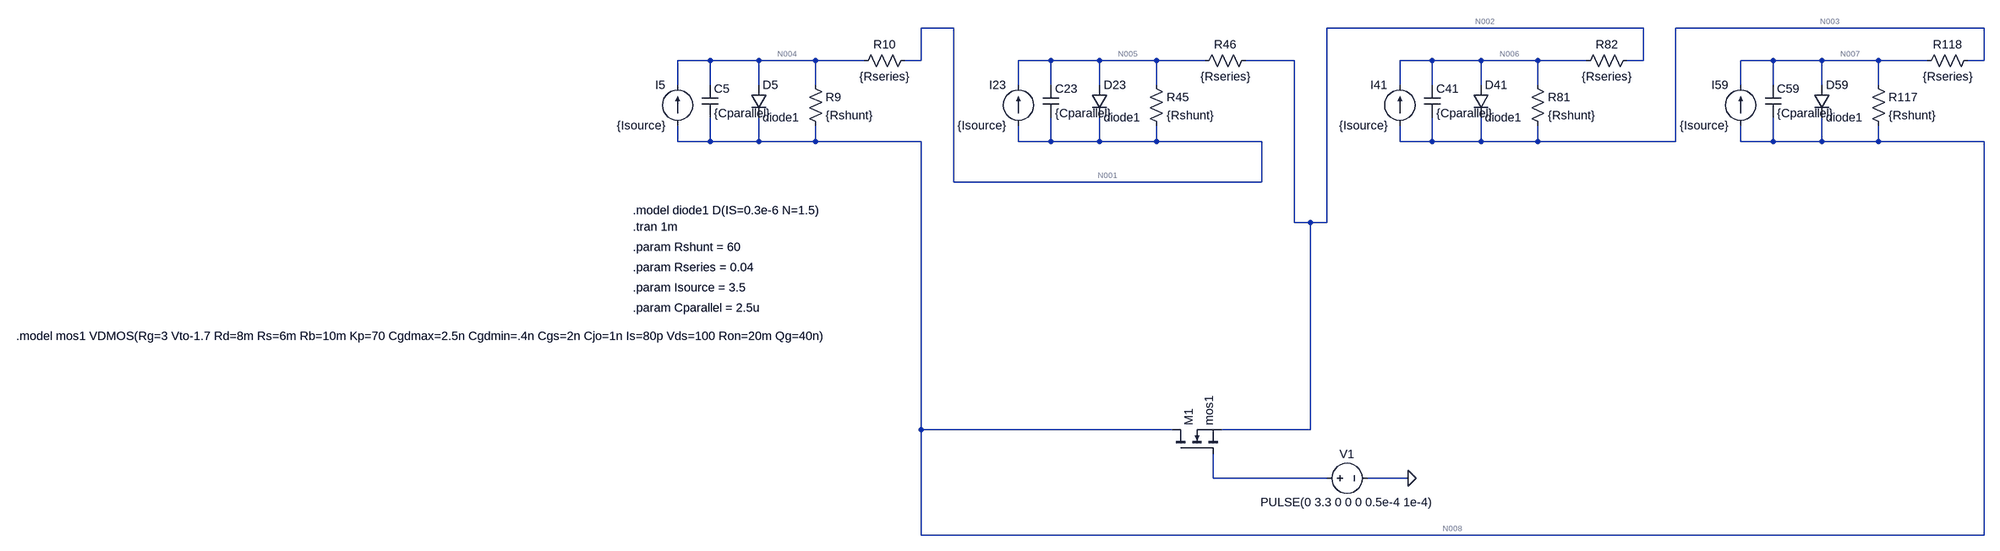
[diagram p0: schematic fetsim3.asc]
fetsim3.asc, the LTspice schematic file:
Version 4
SHEET 1 2564 1908
WIRE 528 848 464 848
WIRE 1888 848 1264 848
WIRE 2560 848 1952 848
WIRE 48 912 -16 912
WIRE 144 912 48 912
WIRE 256 912 144 912
WIRE 352 912 256 912
WIRE 464 912 464 848
WIRE 464 912 432 912
WIRE 720 912 656 912
WIRE 816 912 720 912
WIRE 928 912 816 912
WIRE 1024 912 928 912
WIRE 1200 912 1104 912
WIRE 1472 912 1408 912
WIRE 1568 912 1472 912
WIRE 1680 912 1568 912
WIRE 1776 912 1680 912
WIRE 1888 912 1888 848
WIRE 1888 912 1856 912
WIRE 2144 912 2080 912
WIRE 2240 912 2144 912
WIRE 2352 912 2240 912
WIRE 2448 912 2352 912
WIRE 2560 912 2560 848
WIRE 2560 912 2528 912
WIRE -16 960 -16 912
WIRE 48 960 48 912
WIRE 144 960 144 912
WIRE 256 960 256 912
WIRE 656 960 656 912
WIRE 720 960 720 912
WIRE 816 960 816 912
WIRE 928 960 928 912
WIRE 1408 960 1408 912
WIRE 1472 960 1472 912
WIRE 1568 960 1568 912
WIRE 1680 960 1680 912
WIRE 2080 960 2080 912
WIRE 2144 960 2144 912
WIRE 2240 960 2240 912
WIRE 2352 960 2352 912
WIRE -16 1072 -16 1040
WIRE 48 1072 48 1024
WIRE 48 1072 -16 1072
WIRE 144 1072 144 1024
WIRE 144 1072 48 1072
WIRE 256 1072 256 1040
WIRE 256 1072 144 1072
WIRE 464 1072 256 1072
WIRE 656 1072 656 1040
WIRE 720 1072 720 1024
WIRE 720 1072 656 1072
WIRE 816 1072 816 1024
WIRE 816 1072 720 1072
WIRE 928 1072 928 1040
WIRE 928 1072 816 1072
WIRE 1136 1072 928 1072
WIRE 1408 1072 1408 1040
WIRE 1472 1072 1472 1024
WIRE 1472 1072 1408 1072
WIRE 1568 1072 1568 1024
WIRE 1568 1072 1472 1072
WIRE 1680 1072 1680 1040
WIRE 1680 1072 1568 1072
WIRE 1952 1072 1952 848
WIRE 1952 1072 1680 1072
WIRE 2080 1072 2080 1040
WIRE 2144 1072 2144 1024
WIRE 2144 1072 2080 1072
WIRE 2240 1072 2240 1024
WIRE 2240 1072 2144 1072
WIRE 2352 1072 2352 1040
WIRE 2352 1072 2240 1072
WIRE 2560 1072 2352 1072
WIRE 528 1152 528 848
WIRE 1136 1152 1136 1072
WIRE 1136 1152 528 1152
WIRE 1200 1232 1200 912
WIRE 1232 1232 1200 1232
WIRE 1264 1232 1264 848
WIRE 1264 1232 1232 1232
WIRE 464 1696 464 1072
WIRE 960 1696 464 1696
WIRE 1232 1696 1232 1232
WIRE 1232 1696 1056 1696
WIRE 1040 1792 1040 1744
WIRE 1264 1792 1040 1792
WIRE 1424 1792 1344 1792
WIRE 464 1904 464 1696
WIRE 2560 1904 2560 1072
WIRE 2560 1904 464 1904
FLAG 1424 1792 0
SYMBOL current -16 1040 R180
WINDOW 0 24 80 Left 2
WINDOW 3 24 0 Left 2
WINDOW 123 0 0 Left 2
WINDOW 39 0 0 Left 2
SYMATTR InstName I5
SYMATTR Value {Isource}
SYMBOL cap 32 960 R0
SYMATTR InstName C5
SYMATTR Value {Cparallel}
SYMBOL diode 128 960 R0
SYMATTR InstName D5
SYMATTR Value diode1
SYMBOL res 240 944 R0
SYMATTR InstName R9
SYMATTR Value {Rshunt}
SYMBOL res 448 896 R90
WINDOW 0 0 56 VBottom 2
WINDOW 3 32 56 VTop 2
SYMATTR InstName R10
SYMATTR Value {Rseries}
SYMBOL current 656 1040 R180
WINDOW 0 24 80 Left 2
WINDOW 3 24 0 Left 2
WINDOW 123 0 0 Left 2
WINDOW 39 0 0 Left 2
SYMATTR InstName I23
SYMATTR Value {Isource}
SYMBOL cap 704 960 R0
SYMATTR InstName C23
SYMATTR Value {Cparallel}
SYMBOL diode 800 960 R0
SYMATTR InstName D23
SYMATTR Value diode1
SYMBOL res 912 944 R0
SYMATTR InstName R45
SYMATTR Value {Rshunt}
SYMBOL res 1120 896 R90
WINDOW 0 0 56 VBottom 2
WINDOW 3 32 56 VTop 2
SYMATTR InstName R46
SYMATTR Value {Rseries}
SYMBOL current 1408 1040 R180
WINDOW 0 24 80 Left 2
WINDOW 3 24 0 Left 2
WINDOW 123 0 0 Left 2
WINDOW 39 0 0 Left 2
SYMATTR InstName I41
SYMATTR Value {Isource}
SYMBOL cap 1456 960 R0
SYMATTR InstName C41
SYMATTR Value {Cparallel}
SYMBOL diode 1552 960 R0
SYMATTR InstName D41
SYMATTR Value diode1
SYMBOL res 1664 944 R0
SYMATTR InstName R81
SYMATTR Value {Rshunt}
SYMBOL res 1872 896 R90
WINDOW 0 0 56 VBottom 2
WINDOW 3 32 56 VTop 2
SYMATTR InstName R82
SYMATTR Value {Rseries}
SYMBOL current 2080 1040 R180
WINDOW 0 24 80 Left 2
WINDOW 3 24 0 Left 2
WINDOW 123 0 0 Left 2
WINDOW 39 0 0 Left 2
SYMATTR InstName I59
SYMATTR Value {Isource}
SYMBOL cap 2128 960 R0
SYMATTR InstName C59
SYMATTR Value {Cparallel}
SYMBOL diode 2224 960 R0
SYMATTR InstName D59
SYMATTR Value diode1
SYMBOL res 2336 944 R0
SYMATTR InstName R117
SYMATTR Value {Rshunt}
SYMBOL res 2544 896 R90
WINDOW 0 0 56 VBottom 2
WINDOW 3 32 56 VTop 2
SYMATTR InstName R118
SYMATTR Value {Rseries}
SYMBOL nmos 960 1744 R270
SYMATTR InstName M1
SYMATTR Value mos1
SYMBOL voltage 1248 1792 R270
WINDOW 0 32 56 VTop 2
WINDOW 3 -32 56 VBottom 2
WINDOW 123 0 0 Left 2
WINDOW 39 0 0 Left 2
SYMATTR InstName V1
SYMATTR Value PULSE(0 3.3 0 0 0 0.5e-4 1e-4)
TEXT -104 1208 Left 2 !.model diode1 D(IS=0.3e-6 N=1.5)
TEXT -104 1240 Left 2 !.tran 1m
TEXT -104 1280 Left 2 !.param Rshunt = 60
TEXT -104 1320 Left 2 !.param Rseries = 0.04
TEXT -104 1360 Left 2 !.param Isource = 3.5
TEXT -104 1400 Left 2 !.param Cparallel = 2.5u
TEXT -1320 1456 Left 2 !.model mos1 VDMOS(Rg=3 Vto-1.7 Rd=8m Rs=6m Rb=10m Kp=70 Cgdmax=2.5n Cgdmin=.4n Cgs=2n Cjo=1n Is=80p Vds=100 Ron=20m Qg=40n)

The netlist it stands for:
* fetsim3.asc
I5 N008 N004 {Isource}
C5 N004 N008 {Cparallel}
D5 N004 N008 diode1
R9 N004 N008 {Rshunt}
R10 N001 N004 {Rseries}
I23 N001 N005 {Isource}
C23 N005 N001 {Cparallel}
D23 N005 N001 diode1
R45 N005 N001 {Rshunt}
R46 N002 N005 {Rseries}
I41 N003 N006 {Isource}
C41 N006 N003 {Cparallel}
D41 N006 N003 diode1
R81 N006 N003 {Rshunt}
R82 N002 N006 {Rseries}
I59 N008 N007 {Isource}
C59 N007 N008 {Cparallel}
D59 N007 N008 diode1
R117 N007 N008 {Rshunt}
R118 N003 N007 {Rseries}
M1 N008 N009 N002 N002 mos1
V1 N009 0 PULSE(0 3.3 0 0 0 0.5e-4 1e-4)
.model D D
.lib standard.dio
.model NMOS NMOS
.model PMOS PMOS
.lib standard.mos
.model diode1 D(IS=0.3e-6 N=1.5)
.tran 1m
.param Rshunt = 60
.param Rseries = 0.04
.param Isource = 3.5
.param Cparallel = 2.5u
.model mos1 VDMOS(Rg=3 Vto-1.7 Rd=8m Rs=6m Rb=10m Kp=70 Cgdmax=2.5n Cgdmin=.4n Cgs=2n Cjo=1n Is=80p Vds=100 Ron=20m Qg=40n)
.backanno
.end

* Results of the author's LTspice run, read from the files saved beside the schematic
* Operating Point, zero values left out:
*   V(n008) = -350.9 mV
*   V(n004) = 118.8 mV
*   V(n001) = -18.72 mV
*   V(n005) = 451 mV
*   V(n002) = 313.4 mV
*   V(n003) = -18.72 mV
*   V(n006) = 451 mV
*   V(n007) = 118.8 mV
*   Id(M1) = -6.876 A
*   Is(M1) = 6.876 A
*   I(D59) = 54.27 mA
*   I(D41) = 54.27 mA
*   I(D23) = 54.27 mA
*   I(D5) = 54.27 mA
*   I(I59) = 3.5 A
*   I(I41) = 3.5 A
*   I(I23) = 3.5 A
*   I(I5) = 3.5 A
*   I(R118) = -3.438 A
*   I(R117) = 7.828 mA
*   I(R82) = -3.438 A
*   I(R81) = 7.828 mA
*   I(R46) = -3.438 A
*   I(R45) = 7.828 mA
*   I(R10) = -3.438 A
*   I(R9) = 7.828 mA
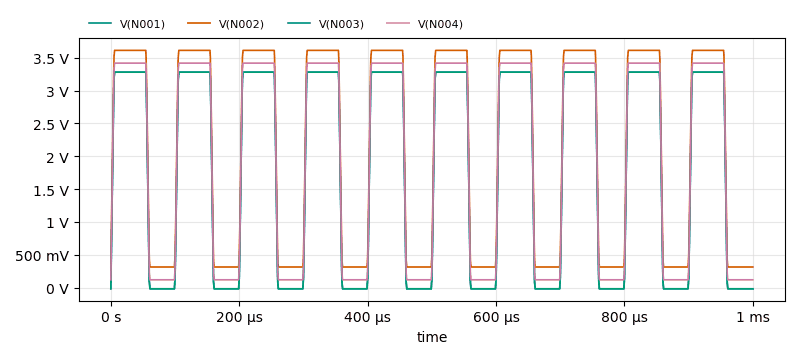
[diagram p1: Transient Analysis of fetsim3.asc, plotted from the saved traces]
* Transient Analysis, 1 run:
*   V(N001): min -18.72 mV, max 3.281 V, average 1.797 V, rms 2.408 V, last -18.72 mV
*   V(N002): min 313.4 mV, max 3.613 V, average 2.129 V, rms 2.665 V, last 313.4 mV
*   V(N003): min -18.72 mV, max 3.281 V, average 1.797 V, rms 2.408 V, last -18.72 mV
*   V(N004): min 118.8 mV, max 3.419 V, average 1.934 V, rms 2.512 V, last 118.8 mV